# EasyEDA Pro project zmk_dongle.epro

# Schematic dongle
Create Date: 2024-05-15; Page Name: P1; Project Name: ts40; Schematic Name: Schematic2; Update Date: 2024-05-16
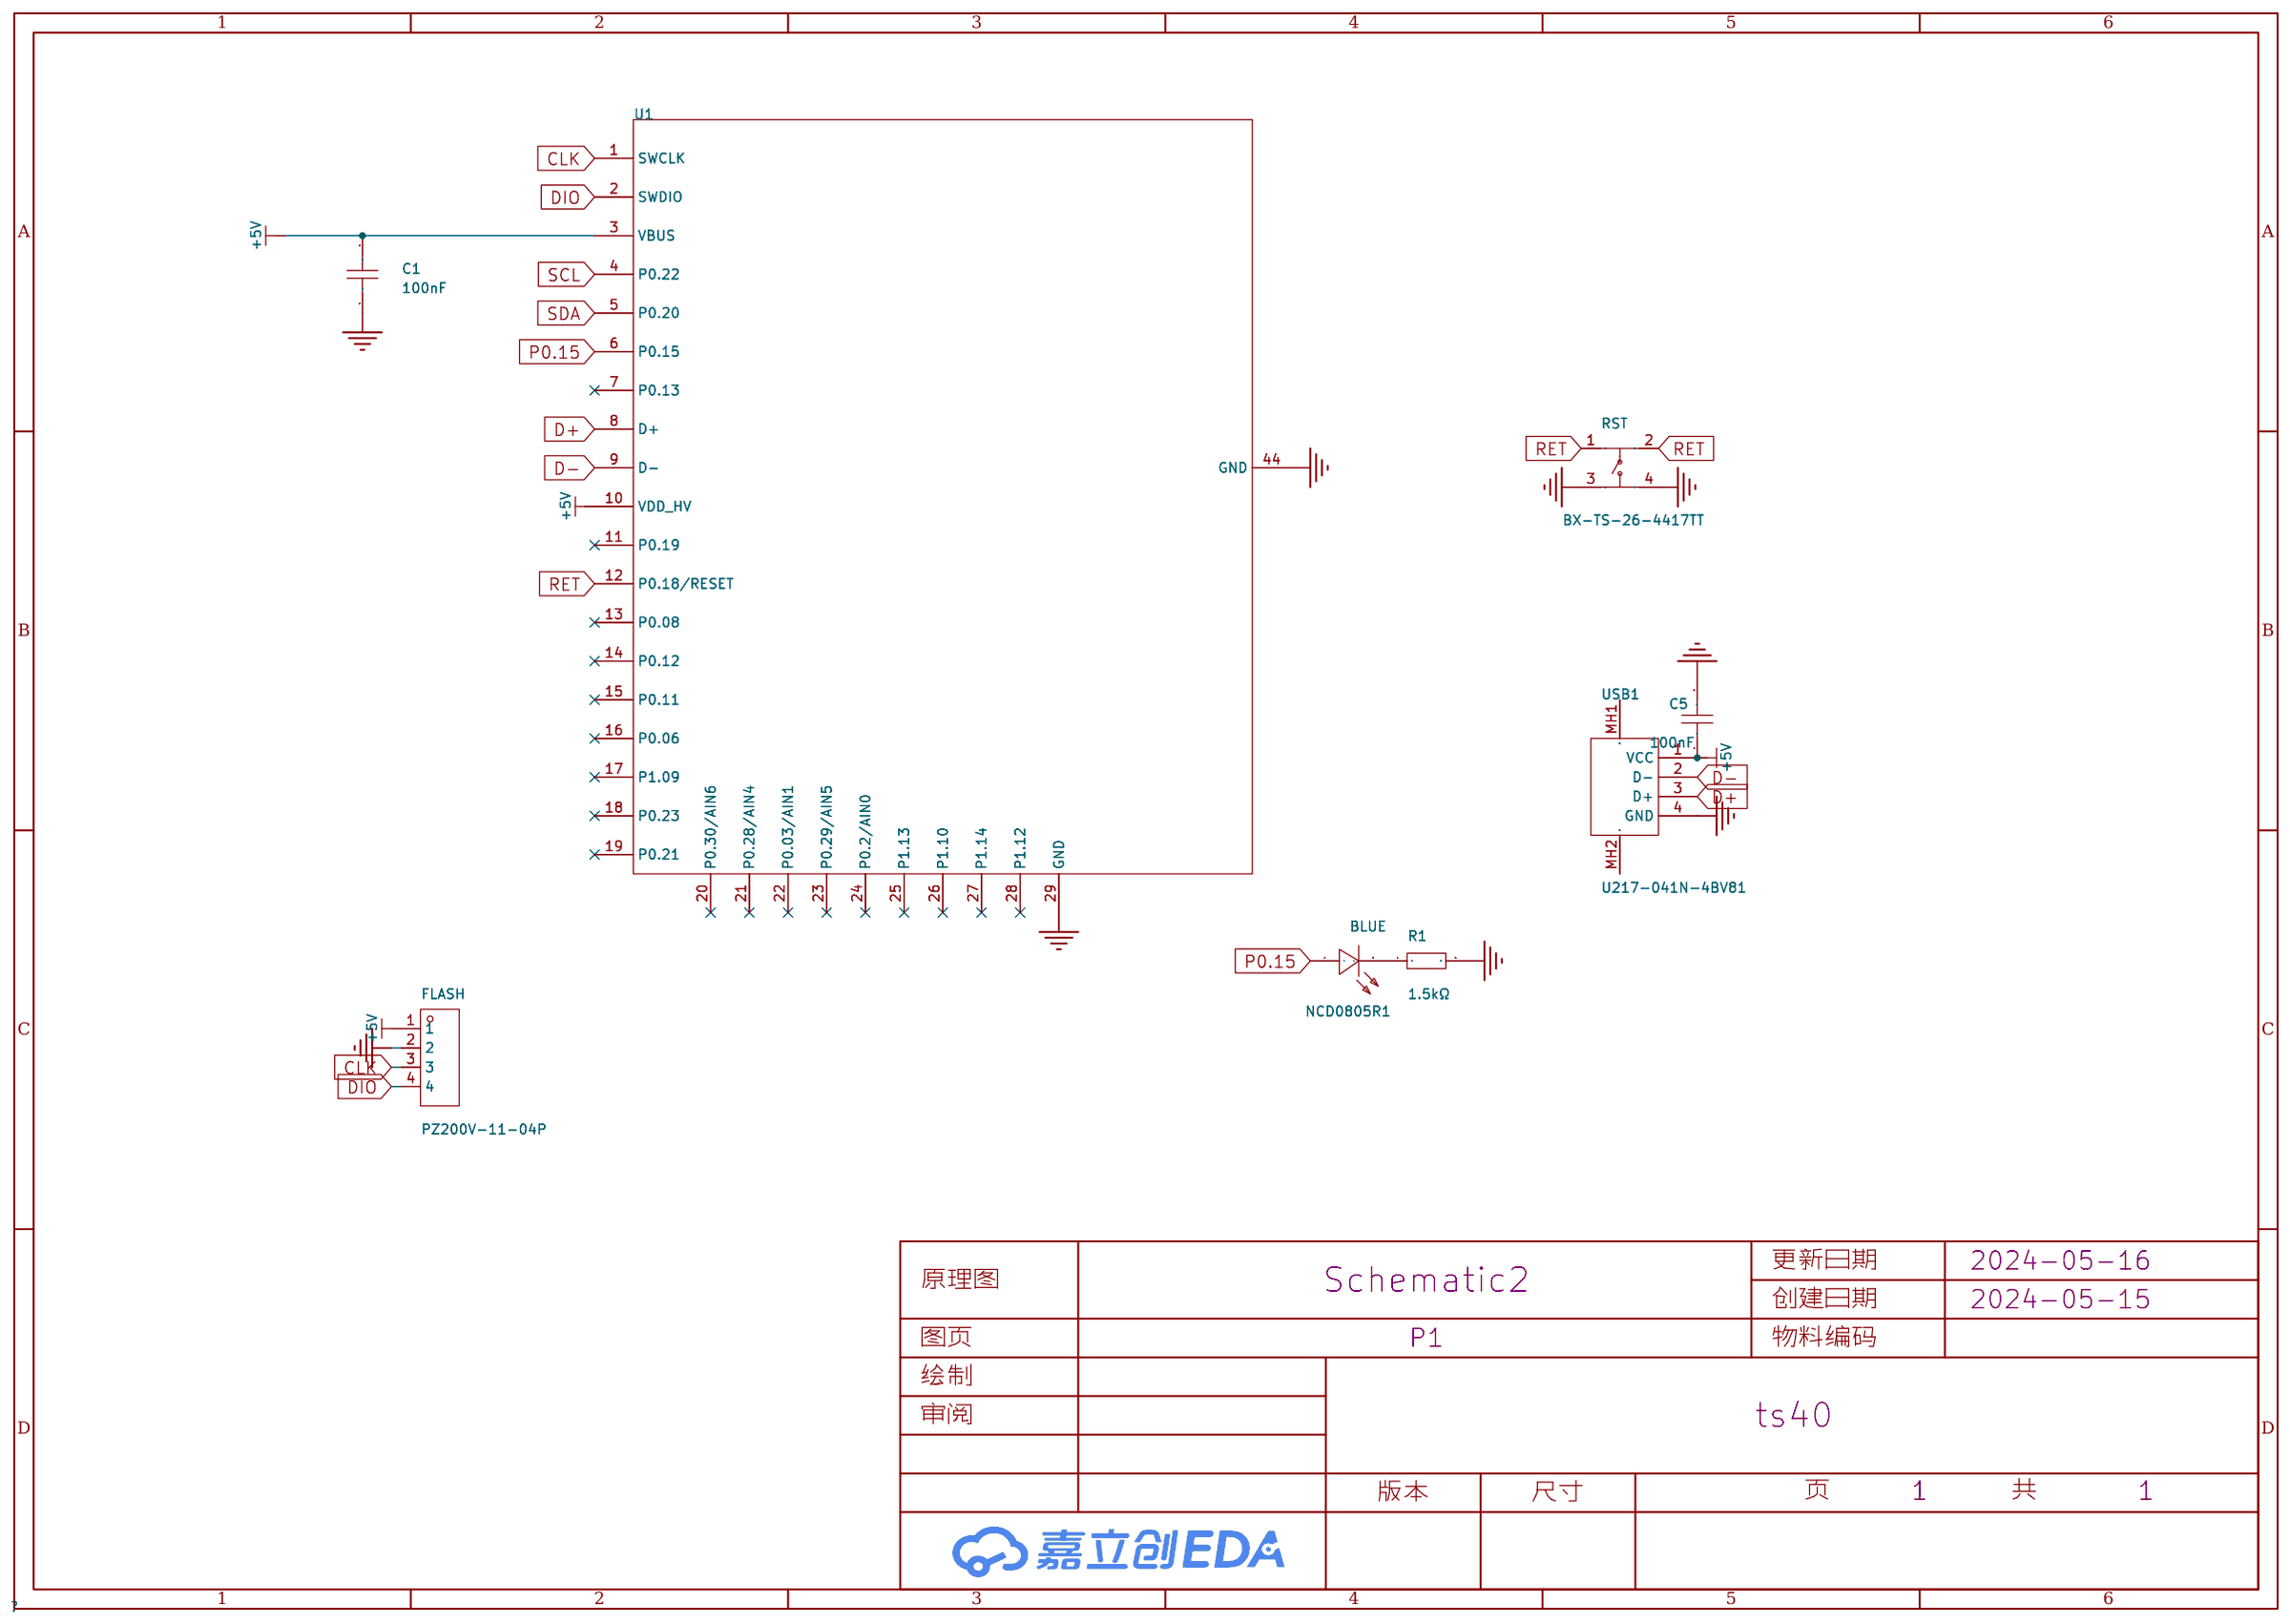
[diagram p0: schematic sheet]

## Parts
BLUE  NCD0805R1  [LED0805-R-RD]
C1  100nF  [C1206]
C5  100nF  [C1206]
FLASH  PZ200V-11-04P  [HDR-TH_4P-P2.00-V-M]
R1  1.5kΩ  [R1206]
RST  BX-TS-26-4417TT  [SW-SMD_4P-L5.2-W5.2-P3.70-LS6.5]
U1  N52840  [52840MICRO-v1]
USB1  U217-041N-4BV81  [USB-A-SMD_U217-041N-4BV81]

## Library data of the parts
BLUE = NCD0805R1: 灯头类型:-;发光颜色:红色;正向电压(VF):1.6V~2.6V;功率:65mW;正向电流:20mA;主波长:615nm~630nm;二极管配置:独立二极管;透镜颜色:无色透明透镜;色温:-;发光强度:67mcd~195mcd;发光角度:130°;载带方式:-;工作温度:-30℃~+85℃;; Supplier Part: C84256; Manufacturer: 国星光电; Supplier Footprint: 0805; JLCPCB Part Class: 基础库; Datasheet: https://atta.szlcsc.com/upload/public/pdf/source/20200820/C84256_F0A75A43B3EAD75808600A0514C76B99.pdf; Supplier: LCSC; Emitted Color: 红色; Forward Voltage (VF): 1.6V~2.6V; Power Dissipation: 65mW; Forward Current: 20mA; Dominant Wavelength: 615nm~630nm; Diode Configuration: 独立二极管; Lens Color: 无色透明透镜; Luminous Intensity: 67mcd~195mcd; Viewing Angle: 130°; Operating Temperature: -30℃~+85℃
C1 C5 = CC0603KRX7R9BB104: 容值:100nF;精度:±10%;额定电压:50V;材质(温度系数):X7R;; LCSC Part Name: 100nF ±10% 50V; Supplier Part: C14663; Manufacturer: YAGEO(国巨); Supplier Footprint: 0603; JLCPCB Part Class: Basic Part; Datasheet: https://atta.szlcsc.com/upload/public/pdf/source/20180910/C282072_33301C7F631E79921B82A8DAC6BCC5B3.pdf; Supplier: LCSC; Tolerance: ±10%; Voltage Rated: 50V; Temperature Coefficient: X7R
FLASH = PZ200V-11-04P: 插针结构:1x4P;间距:2mm;行距:-;圆针/方针:方针;安装类型:直插;排数:单排;总PIN位数:4P;额定电流:-;额定电压:-;配合针长度:3.9mm;塑高:2mm;端接针长度:2.8mm;触头材质:黄铜;触头镀层:-;工作温度范围:-40℃~+105℃;焊接温度(最大值):-;颜色:黑色;; LCSC Part Name: 间距:2mm 1x4P 直插 方针; Supplier Part: C541858; Manufacturer: XFCN(兴飞); Supplier Footprint: 插件,P=2mm; JLCPCB Part Class: 扩展库; Datasheet: https://atta.szlcsc.com/upload/public/pdf/source/20200518/C541858_7610F54454E936EFCDE06B655DF7C837.pdf; Supplier: LCSC; Pin Structure: 1x4P; Pitch: 2mm; Circluar Pins/Square Pins: 方针; Mounting Type: 直插; Number of Rows: 单排; Number of Pins: 4P; Length of Mating Pin: 3.9mm; Insulation Height: 2mm; Length of End Connection Pin: 2.8mm; Contact Material: 黄铜; Operating Temperature Range: -40℃~+105℃; Color: 黑色
R1 = 0805W8F1501T5E: 电阻类型:厚膜电阻;阻值:1.5kΩ;精度:±1%;功率:125mW;最大工作电压:150V;温度系数:±100ppm/℃;; LCSC Part Name: 1.5kΩ ±1% 125mW 厚膜电阻; Supplier Part: C4310; Manufacturer: UNI-ROYAL(厚声); Supplier Footprint: 0805; JLCPCB Part Class: 基础库; Datasheet: https://atta.szlcsc.com/upload/public/pdf/source/20200306/C422600_1E6D84923E4A46A82E41ADD87F860B5C.pdf; Supplier: LCSC; Type: 厚膜电阻; Tolerance: ±1%; Power(Watts): 125mW; Overload Voltage (Max): 150V; Temperature Coefficient: ±100ppm/℃; Operating Temperature Range: -55℃~+155℃
RST = BX-TS-26-4417TT: 电路结构:单刀单掷;按钮形状:圆形按钮;作用力:260gf;安装方式:立贴;开关长度:4mm;开关宽度:4mm;开关高度:1.7mm;带支架:不带;触点电流:50mA;额定电压(AC):250V;额定电压(DC):12V;绝缘电阻:100MΩ;机械寿命:10万次;; LCSC Part Name: 4x4x1.7铜头开关; Supplier Part: C18078110; Manufacturer: Bossie(博锡); Supplier Footprint: SMD-4P,4x4mm; Datasheet: https://atta.szlcsc.com/upload/public/pdf/source/20231017/916BF7A8DB1936A62562F9A253B59526.pdf; Supplier: LCSC; Circuit: 单刀单掷; Actuator Style: 圆形按钮; Operating Force: 260gf; Mounting Style: 立贴; Switch Length: 4mm; Switch Width: 4mm; Switch Height: 1.7mm; Strike Gundam: 不带; Contact Current: 50mA; Voltage Rating (AC): 250V; Voltage Rating (DC): 12V; Insulation Resistance: 100MΩ; Actuator/Cap Color: 金色; Pin Style: 鸥翼型; Mechanical Life: 10万次; Operating Temperature: -30℃~+80℃
U1 = 52840micro_v1
USB1 = U217-041N-4BV81: 连接器类型:Type-A;标准:USB 2.0;公母:公;端口数量:1;触点数量:4P;安装方式:沉板;额定电流 - 电源:1.5A;触头材质:黄铜;触头镀层:金;工作温度范围:-40℃~+85℃;焊接温度(最大值):-;; LCSC Part Name: Type-A 公 沉板; Supplier Part: C319178; Manufacturer: XKB Connectivity(中国星坤); Supplier Footprint: SMD; JLCPCB Part Class: Extended Part; Datasheet: https://atta.szlcsc.com/upload/public/pdf/source/20211015/D42E73CBE112FBE216C7DAC502068881.pdf; Supplier: LCSC; Connector Type: Type-A; Standard: USB 2.0; Gender: 公; Number of Ports: 1; Number of Contacts: 4P; Mounting Style: 沉板; Current Rating - Power (Max): 1.5A; Contact Material: 黄铜; Contact Plating: 金; Operating Temperature Range: -40℃~+85℃

## Nets
+5V: C1.2 C5.1 FLASH.1 U1.3(VBUS) U1.10(VDD_HV) USB1.1(VCC)
GND: C1.1 C5.2 FLASH.2 R1.2 RST.3 RST.4 U1.29(GND) U1.44(GND) USB1.4(GND)
CLK: FLASH.3 U1.1(SWCLK)
D+: U1.8(D+) USB1.3(D+)
D-: U1.9(D-) USB1.2(D-)
DIO: FLASH.4 U1.2(SWDIO)
P0.15: BLUE.1(+) U1.6(P0.15)
RET: RST.1 RST.2 U1.12(P0.18/RESET)
SCL: U1.4(P0.22)
SDA: U1.5(P0.20)
$1N1294: BLUE.2(-) R1.1

Not connected (* = marked no-connect by the designer): U1 7(P0.13)* 11(P0.19)* 13(P0.08)* 14(P0.12)* 15(P0.11)* 16(P0.06)* 17(P1.09)* 18(P0.23)* 19(P0.21)* 20(P0.30/AIN6)* 21(P0.28/AIN4)* 22(P0.03/AIN1)* 23(P0.29/AIN5)* 24(P0.2/AIN0)* 25(P1.13)* 26(P1.10)* 27(P1.14)* 28(P1.12)*; USB1 MH1 MH2

# Board dongle
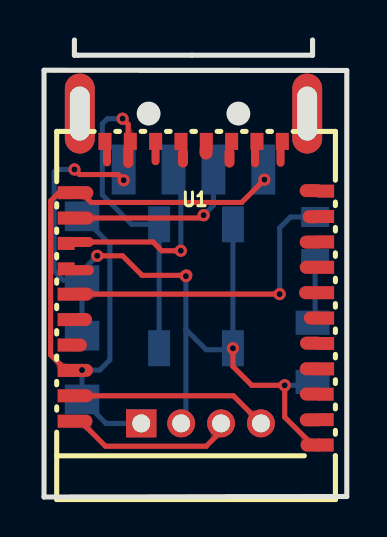
[diagram p1: board, top side]
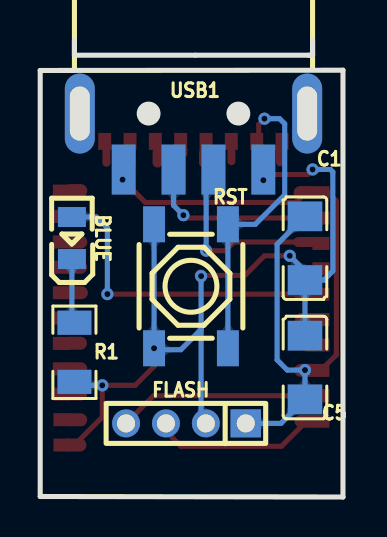
[diagram p2: board, bottom side, seen from below]

Outline 15.18 x 22.86 mm; copper layers: Top Layer, Bottom Layer. Coordinates in mm from the lower left corner of the outline.
Outline path: 0,21.35 15.18,21.34 15.18,0.03 0,0 0,21.35
Stack: Top Layer 0.035mm / Dielectric1 1.51mm FR4 er 4.5 / Bottom Layer 0.035mm

## Design rules (mm)
template: 自定义配置
spacing customer_rule (default): track to track 0.203, other pairs 0.203 to 0.203
track width custom_style (default): min 0.254, default 0.254, max 0.762
track width vcc_gnd: min 0.254, default 0.762, max 0.762
differential pair differentialPair (default): width min 0.127, default 0.254, max 2.54; gap min 0.152, default 0.152
via viaSize (default): diameter min 0.5, default 0.61, max 10; hole min 0.3, default 0.305, max 6.299

## Placement (name value [footprint] x y rotation side)
BLUE  NCD0805R1  [LED0805-R-RD]  13.59 12.95 90 bottom
C1  100nF  [C1206]  1.91 12.45 90 bottom
C5  100nF  [C1206]  1.91 6.48 90 bottom
FLASH  PZ200V-11-04P  [HDR-TH_4P-P2.00-V-M]  7.87 3.68 0 bottom
R1  1.5kΩ  [R1206]  13.46 7.24 270 bottom
RST  BX-TS-26-4417TT  [SW-SMD_4P-L5.2-W5.2-P3.70-LS6.5]  7.62 10.54 270 bottom
U1  N52840  [52840MICRO-v1]  0.76 18.29 270 top
USB1  U217-041N-4BV81  [USB-A-SMD_U217-041N-4BV81]  7.49 17.78 0 bottom

## Footprints (pads in the part's own frame, mm; a bottom-side part is the same pattern mirrored in y, then rotated)
52840MICRO-v1
  oval 0.65x1.2 smd: 1(14.493,1.065) 2(13.223,1.07) 3(11.954,1.085) 5(9.409,1.04) 6(8.139,1.095) 9(4.333,1.109) 10(3.063,1.109) 19(2.963,12.655) 21(5.538,12.655) 22(6.798,12.66) 23(8.069,12.625) 25(10.594,12.67) 26(11.873,12.66) 27(13.139,12.665) 28(14.428,12.66) 29(15.688,12.7)
  rect 0.65x0.85 smd: 1(14.495,0.346) 2(13.225,0.346) 3(11.955,0.346) 4(10.685,0.346) 5(9.415,0.346) 6(8.145,0.346) 7(6.875,0.346) 8(5.605,0.346) 9(4.335,0.346) 10(3.065,0.346) 19(2.988,13.355) 20(4.258,13.355) 21(5.528,13.355) 22(6.798,13.355) 23(8.068,13.355) 24(9.338,13.355) 25(10.608,13.355) 26(11.878,13.355)
  oval 0.65x0.9 smd: 4(10.688,0.934)
  oval 0.5x1.2 smd: 7(6.944,1.135) 8(5.534,1.13)
  rect 0.85x0.65 smd: 11(0.501,2.293) 12(0.501,3.563) 13(0.501,4.833) 14(0.501,6.103) 15(0.501,7.373) 16(0.501,8.643) 17(0.501,9.913) 18(0.501,11.183)
  oval 1x0.4 smd: 11(1.248,2.394) 17(1.298,9.815) 18(1.268,11.095)
  oval 1.2x0.5 smd: 12(1.228,3.459)
  oval 0.9x0.4 smd: 13(1.239,4.83)
  oval 1x0.5 smd: 14(1.308,6.205) 16(1.308,8.534)
  oval 0.8x0.65 smd: 15(1.004,7.359)
  oval 0.65x1 smd: 20(4.269,12.705) 24(9.334,12.765)
  rect 0.65x0.8 smd: 27(13.148,13.355) 28(14.418,13.355) 29(15.688,13.355)
  round 0.6 smd: 44(7.199,6.375)
C1206
  rect 1.485x1.728 smd: 1(-1.593,0) 2(1.593,0)
HDR-TH_4P-P2.00-V-M
  rect 1.524x1.4 hole 0.9: 1(-3,0)
  round 1.4 hole 0.9: 2(-1,0) 3(1,0) 4(3,0)
LED0805-R-RD
  rect 1x1.399 smd: 1(1.05,0) 2(-1.05,0)
R1206
  rect 1.208x1.701 smd: 1(-1.479,0) 2(1.479,0)
SW-SMD_4P-L5.2-W5.2-P3.70-LS6.5
  rect 1.8x1.1 smd: 1(-3.1,1.85) 2(3.1,1.85) 3(-3.1,-1.85) 4(3.1,-1.85)
USB-A-SMD_U217-041N-4BV81
  rect 1.2x2.5 smd: 1(3.5,1.4) 2(1,1.4) 3(-1,1.4) 4(-3.5,1.4)
  oval 1.5x4 hole 1x2.7: 5(-5.7,-1.4) 6(5.7,-1.4)

## Nets
As in the schematic.

Pads without a net: U1 7 11 13 14 15 16 17 18 19 20 21 22 23 24 25 26 27 28; USB1 5 6

## Via types
v1: diameter 0.61, hole 0.305, Top Layer to Bottom Layer, 12 vias

## Routing (per net, layer and track width the routed paths; a pad name or vN(x,y) marks a point on that pad's centre or on a via; arc(x,y) is an arc through that point)
+5V: length 33.9
  Top Layer w0.254: U1.10 2.36,14.73 9.91,14.73 v1(11.05,15.88) ; U1.3 0.33,7.11 0.33,14.81 0.75,15.22 U1.10
  Bottom Layer w0.254: FLASH.1 3.11,3.68 C5.1 v1(1.91,6.35) 2.79,6.35 3.3,6.86 3.3,12.64 C1.2
GND: length 44.9
  Top Layer w0.254: v1(1.52,16.38) 1.78,16.13 3.71,16.13 v1(3.99,15.84) ; U1.29 12.07,4 v1(12.07,5.59) 10.41,5.59 9.47,6.53 v1(9.47,7.44) ; U1.44 4.91,11.09 3.94,12.06 v1(2.67,12.06)
  Bottom Layer w0.254: v1(12.07,5.59) 13.29,5.59 R1.2 ; 9.47,13.64 v1(9.47,7.44) 9.4,7.37 8.13,7.37 7.11,8.38 ; v1(2.67,12.06) 1.91,11.3 C1.1 ; FLASH.2 7.11,3.92 7.11,8.38 ; v1(7.11,11.05) 7.11,8.38 ; C1.1 C5.2 ; C1.1 0.96,10.85 0.51,11.3 0.51,16.26 0.64,16.38 v1(1.52,16.38)
CLK: length 8.3
  Top Layer w0.254: U1.1 3.08,2.54 8.13,2.54 8.87,3.29 FLASH.3
D+: length 9.4
  Top Layer w0.254: U1.8 5.46,12.75 5.9,12.32 v1(6.86,12.32)
  Bottom Layer w0.254: v1(6.86,12.32) 6.86,16.02 USB1.3
D-: length 8.7
  Top Layer w0.254: v1(8,14.1) 7.86,13.95 U1.9
  Bottom Layer w0.254: USB1.2 8.49,14.59 v1(8,14.1)
DIO: length 9.6
  Top Layer w0.254: U1.2 9.49,5.06 FLASH.4
P0.15: length 15.3
  Top Layer w0.254: v1(11.81,10.15) U1.6
  Bottom Layer w0.254: BLUE.1 12.35,14 11.81,13.46 v1(11.81,10.15)
RET: length 16.3
  Top Layer w0.254: U1.12 4.22,18.64 v1(3.94,18.92)
  Bottom Layer w0.254: RST.2 5.77,13.64 4.39,13.64 2.92,15.11 2.92,18.67 3.18,18.92 v1(3.94,18.92)
$1N1294: length 3.2
  Bottom Layer w0.254: R1.1 13.59,8.84 BLUE.2

## Copper pours and planes (outline as drawn; the poured copper is in the pictures)
GND on Top Layer: -0.63,22.1 15.62,22.1 15.62,-0.89 -0.63,-0.89
GND on Bottom Layer: -0.76,22.1 15.62,22.1 15.62,-1.02 -0.76,-1.02

Small or netless copper shapes (teardrops, artwork), in the pictures only: 28 on Top Layer, 33 on Bottom Layer
